# Altium schematic sheet Connections.SchDoc
size A; SheetNumber: 2; SheetTotal: 2
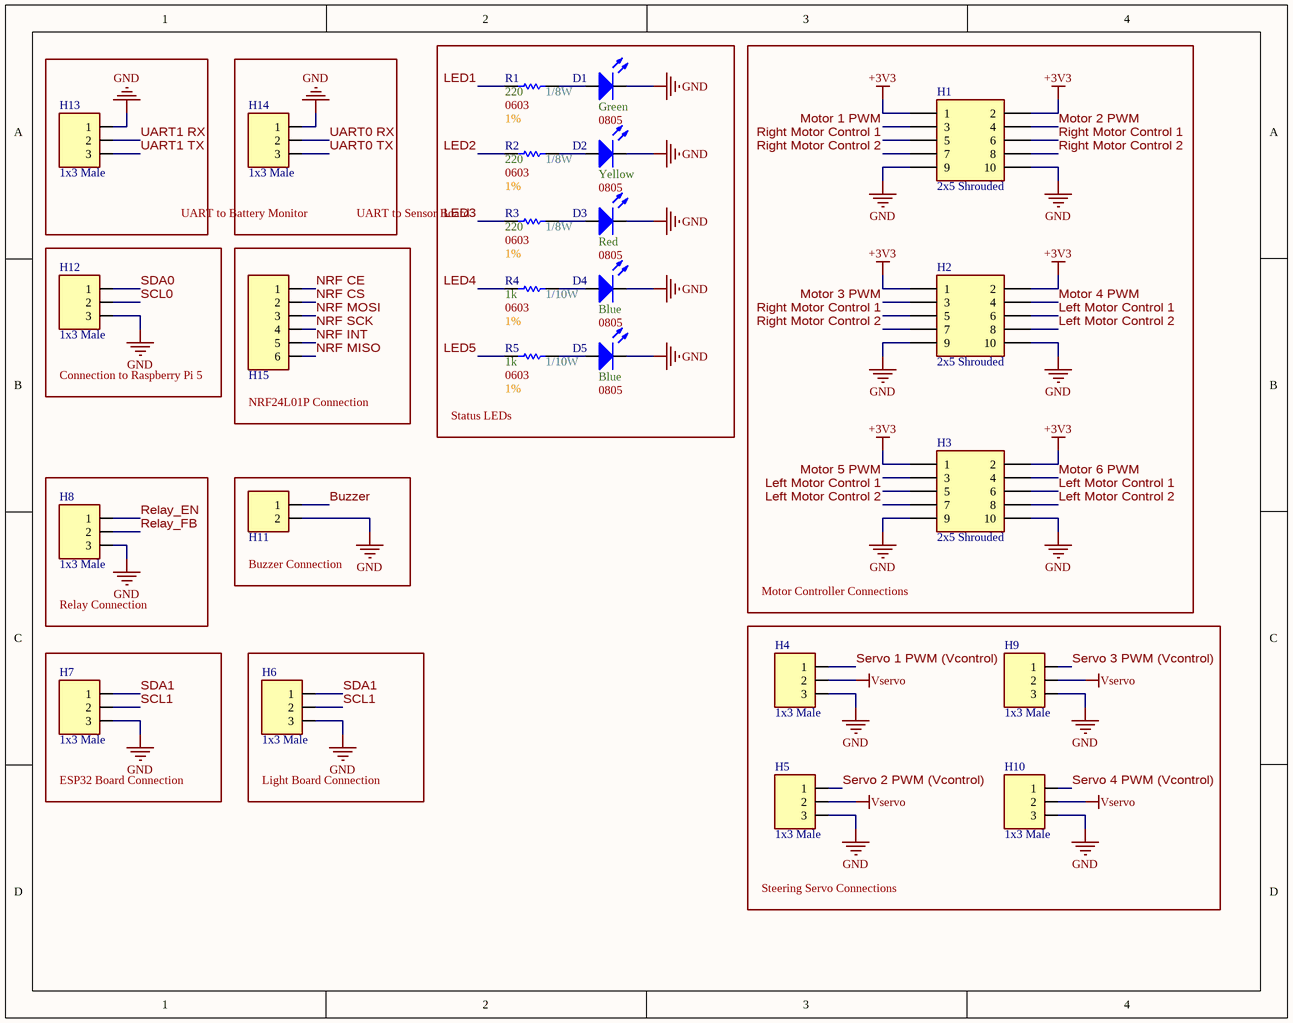
[diagram p0: Connections.SchDoc]

## Parts
D1  Color: Green  Size Package: 0805  [[LED] SMD 0805]  (hidden comment: [LED] SMD 0805 Green)
D2  Color: Yellow  Size Package: 0805  [[LED] SMD 0805]  (hidden comment: [LED] SMD 0805 Yellow)
D3  Color: Red  Size Package: 0805  [[LED] SMD 0805]  (hidden comment: [LED] SMD 0805 Red)
D4  Color: Blue  Size Package: 0805  [[LED] SMD 0805]  (hidden comment: [LED] SMD 0805 Blue)
D5  Color: Blue  Size Package: 0805  [[LED] SMD 0805]  (hidden comment: [LED] SMD 0805 Blue)
H1  2x5 Shrouded  [[Header] Shrouded 2x5 Male]
H2  2x5 Shrouded  [[Header] Shrouded 2x5 Male]
H3  2x5 Shrouded  [[Header] Shrouded 2x5 Male]
H4  1x3 Male  [[Header] Shrouded 1x3 Male]
H5  1x3 Male  [[Header] Shrouded 1x3 Male]
H6  1x3 Male  [[Header] Shrouded 1x3 Male]
H7  1x3 Male  [[Header] Shrouded 1x3 Male]
H8  1x3 Male  [[Header] Shrouded 1x3 Male]
H9  1x3 Male  [[Header] Shrouded 1x3 Male]
H10  1x3 Male  [[Header] Shrouded 1x3 Male]
H11  1x2 Male  [[Header] Shrouded 1x2 Male]  (value not drawn)
H12  1x3 Male  [[Header] Shrouded 1x3 Male]
H13  1x3 Male  [[Header] Shrouded 1x3 Male]
H14  1x3 Male  [[Header] Shrouded 1x3 Male]
H15  [Header] Shrouded 1x6 Male  [[Header] Shrouded 1x6 Male]  (value not drawn)
R1  Wattage: 1/8W  Tolerance: 1%  Resistance: 220  Size Package: 0603  [[Res] SMD 0603]  (hidden comment: [220] SMD 0603 1% 1/10W)
R2  Wattage: 1/8W  Tolerance: 1%  Resistance: 220  Size Package: 0603  [[Res] SMD 0603]  (hidden comment: [220] SMD 0603 1% 1/10W)
R3  Wattage: 1/8W  Tolerance: 1%  Resistance: 220  Size Package: 0603  [[Res] SMD 0603]  (hidden comment: [220] SMD 0603 1% 1/10W)
R4  Wattage: 1/10W  Tolerance: 1%  Resistance: 1k  Size Package: 0603  [[Res] SMD 0603]  (hidden comment: [1k] SMD 0603 1% 1/10W)
R5  Wattage: 1/10W  Tolerance: 1%  Resistance: 1k  Size Package: 0603  [[Res] SMD 0603]  (hidden comment: [1k] SMD 0603 1% 1/10W)

## Blocks framed on the sheet
UART to Battery Monitor: H13
UART to Sensor Board: H14
Status LEDs: D1-D5 R1-R5
Motor Controller Connections: H1-H3
Connection to Raspberry Pi 5: H12
NRF24L01P Connection: H15
Relay Connection: H8
Buzzer Connection: H11
ESP32 Board Connection: H7
Light Board Connection: H6
Steering Servo Connections: H4 H5 H9 H10

## Nets
+3V3: H1.1 H1.2 H2.1 H2.2 H3.1 H3.2
GND: D1.2(Cathode) D2.2(Cathode) D3.2(Cathode) D4.2(Cathode) D5.2(Cathode) H1.9 H1.10 H2.9 H2.10 H3.9 H3.10 H4.3 H5.3 H6.3 H7.3 H8.3 H9.3 H10.3 H11.2 H12.3 H13.1 H14.1
Vservo: H4.2 H5.2 H9.2 H10.2
Buzzer: H11.1
LED1: R1.1
LED2: R2.1
LED3: R3.1
LED4: R4.1
LED5: R5.1
Left Motor Control 1: H2.6 H3.5 H3.6
Left Motor Control 2: H2.8 H3.7 H3.8
Motor 1 PWM: H1.3
Motor 2 PWM: H1.4
Motor 3 PWM: H2.3
Motor 4 PWM: H2.4
Motor 5 PWM: H3.3
Motor 6 PWM: H3.4
NRF CE: H15.1
NRF CS: H15.2
NRF INT: H15.5
NRF MISO: H15.6
NRF MOSI: H15.3
NRF SCK: H15.4
Relay_EN: H8.1
Relay_FB: H8.2
Right Motor Control 1: H1.5 H1.6 H2.5
Right Motor Control 2: H1.7 H1.8 H2.7
SCL0: H12.2
SCL1: H6.2 H7.2
SDA0: H12.1
SDA1: H6.1 H7.1
Servo 1 PWM (Vcontrol): H4.1
Servo 2 PWM (Vcontrol): H5.1
Servo 3 PWM (Vcontrol): H9.1
Servo 4 PWM (Vcontrol): H10.1
UART0 RX: H14.2
UART0 TX: H14.3
UART1 RX: H13.2
UART1 TX: H13.3
NetD1_1: D1.1(Anode) R1.2
NetD2_1: D2.1(Anode) R2.2
NetD3_1: D3.1(Anode) R3.2
NetD4_1: D4.1(Anode) R4.2
NetD5_1: D5.1(Anode) R5.2

## Library data of the parts
D1 = [LED] SMD 0805 Green: LG R971-KN-1-0-20-R18; Supplier 1: DigiKey; Supplier Part Number 1: 475-LGR971-KN-1CT-ND
D2 = [LED] SMD 0805 Yellow: LY R976-PS-36-0-20-R18; Supplier 1: DigiKey; Supplier Part Number 1: 475-LYR976-PS-36-0-20-R18CT-ND
D3 = [LED] SMD 0805 Red: LS R976-NR-1-0-20-R18; Supplier 1: DigiKey; Supplier Part Number 1: 475-LSR976-NR-1CT-ND
D4 D5 = [LED] SMD 0805 Blue: 150080BS75000; Supplier 1: DigiKey; Supplier Part Number 1: 732-4982-1-ND
H1-H3 = [Header] Shrouded 2x5 Male: BHR-10-VUA; Supplier 1: DigiKey; Supplier Part Number 1: 2057-BHR-10-VUA-ND
H4-H10 H12-H14 = [Header] Shrouded 1x3 Male: 070543-0037 / Mates with 005057-9403; Supplier 1: DigiKey; Supplier Part Number 1: WM4825-ND
  H4-H10 H12 H14: Supplier 2: DigiKey; Supplier Part Number 2: WM2901-ND
H11 = [Header] Shrouded 1x2 Male: 0705430036 / Mates with 0050579402; Supplier 1: DigiKey; Supplier 2: DigiKey; Supplier Part Number 2: WM2900-ND; Supplier Part Number 1: WM4824-ND
H15 = [Header] Shrouded 1x6 Male: 0705430005 / Mates with 0050579406; Supplier 1: DigiKey; Supplier 2: DigiKey; Supplier Part Number 1: WM4804-ND; Supplier Part Number 2: WM2904-ND
R1-R3 = [220] SMD 0603 1% 1/10W: CRGCQ0805F220R; Supplier 1: DigiKey; Supplier Part Number 1: A129741CT-ND
R4 R5 = [1k] SMD 0603 1% 1/10W: RMCF0603FT1K00; Supplier 1: DigiKey; Supplier Part Number 1: RMCF0603FT1K00DKR-ND